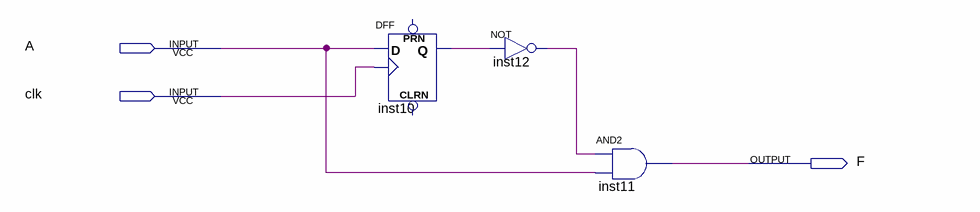
[diagram p0: schematic sheet]
// Quartus schematic prueba.bdf as structural Verilog: 3 symbols, 3 pins
module prueba (
  input  A,
  input  clk,
  output F
);

  wire inst10_q, inst12_out;

  DFF inst10 (.CLK(clk), .D(A), .Q(inst10_q));  // open: CLRN, PRN
  not inst12 (inst12_out, inst10_q);
  and inst11 (F, inst12_out, A);
endmodule
